# Altium schematic sheet NixieClockv1.1.SchDoc
size A3; SheetNumber: 1; SheetTotal: 1
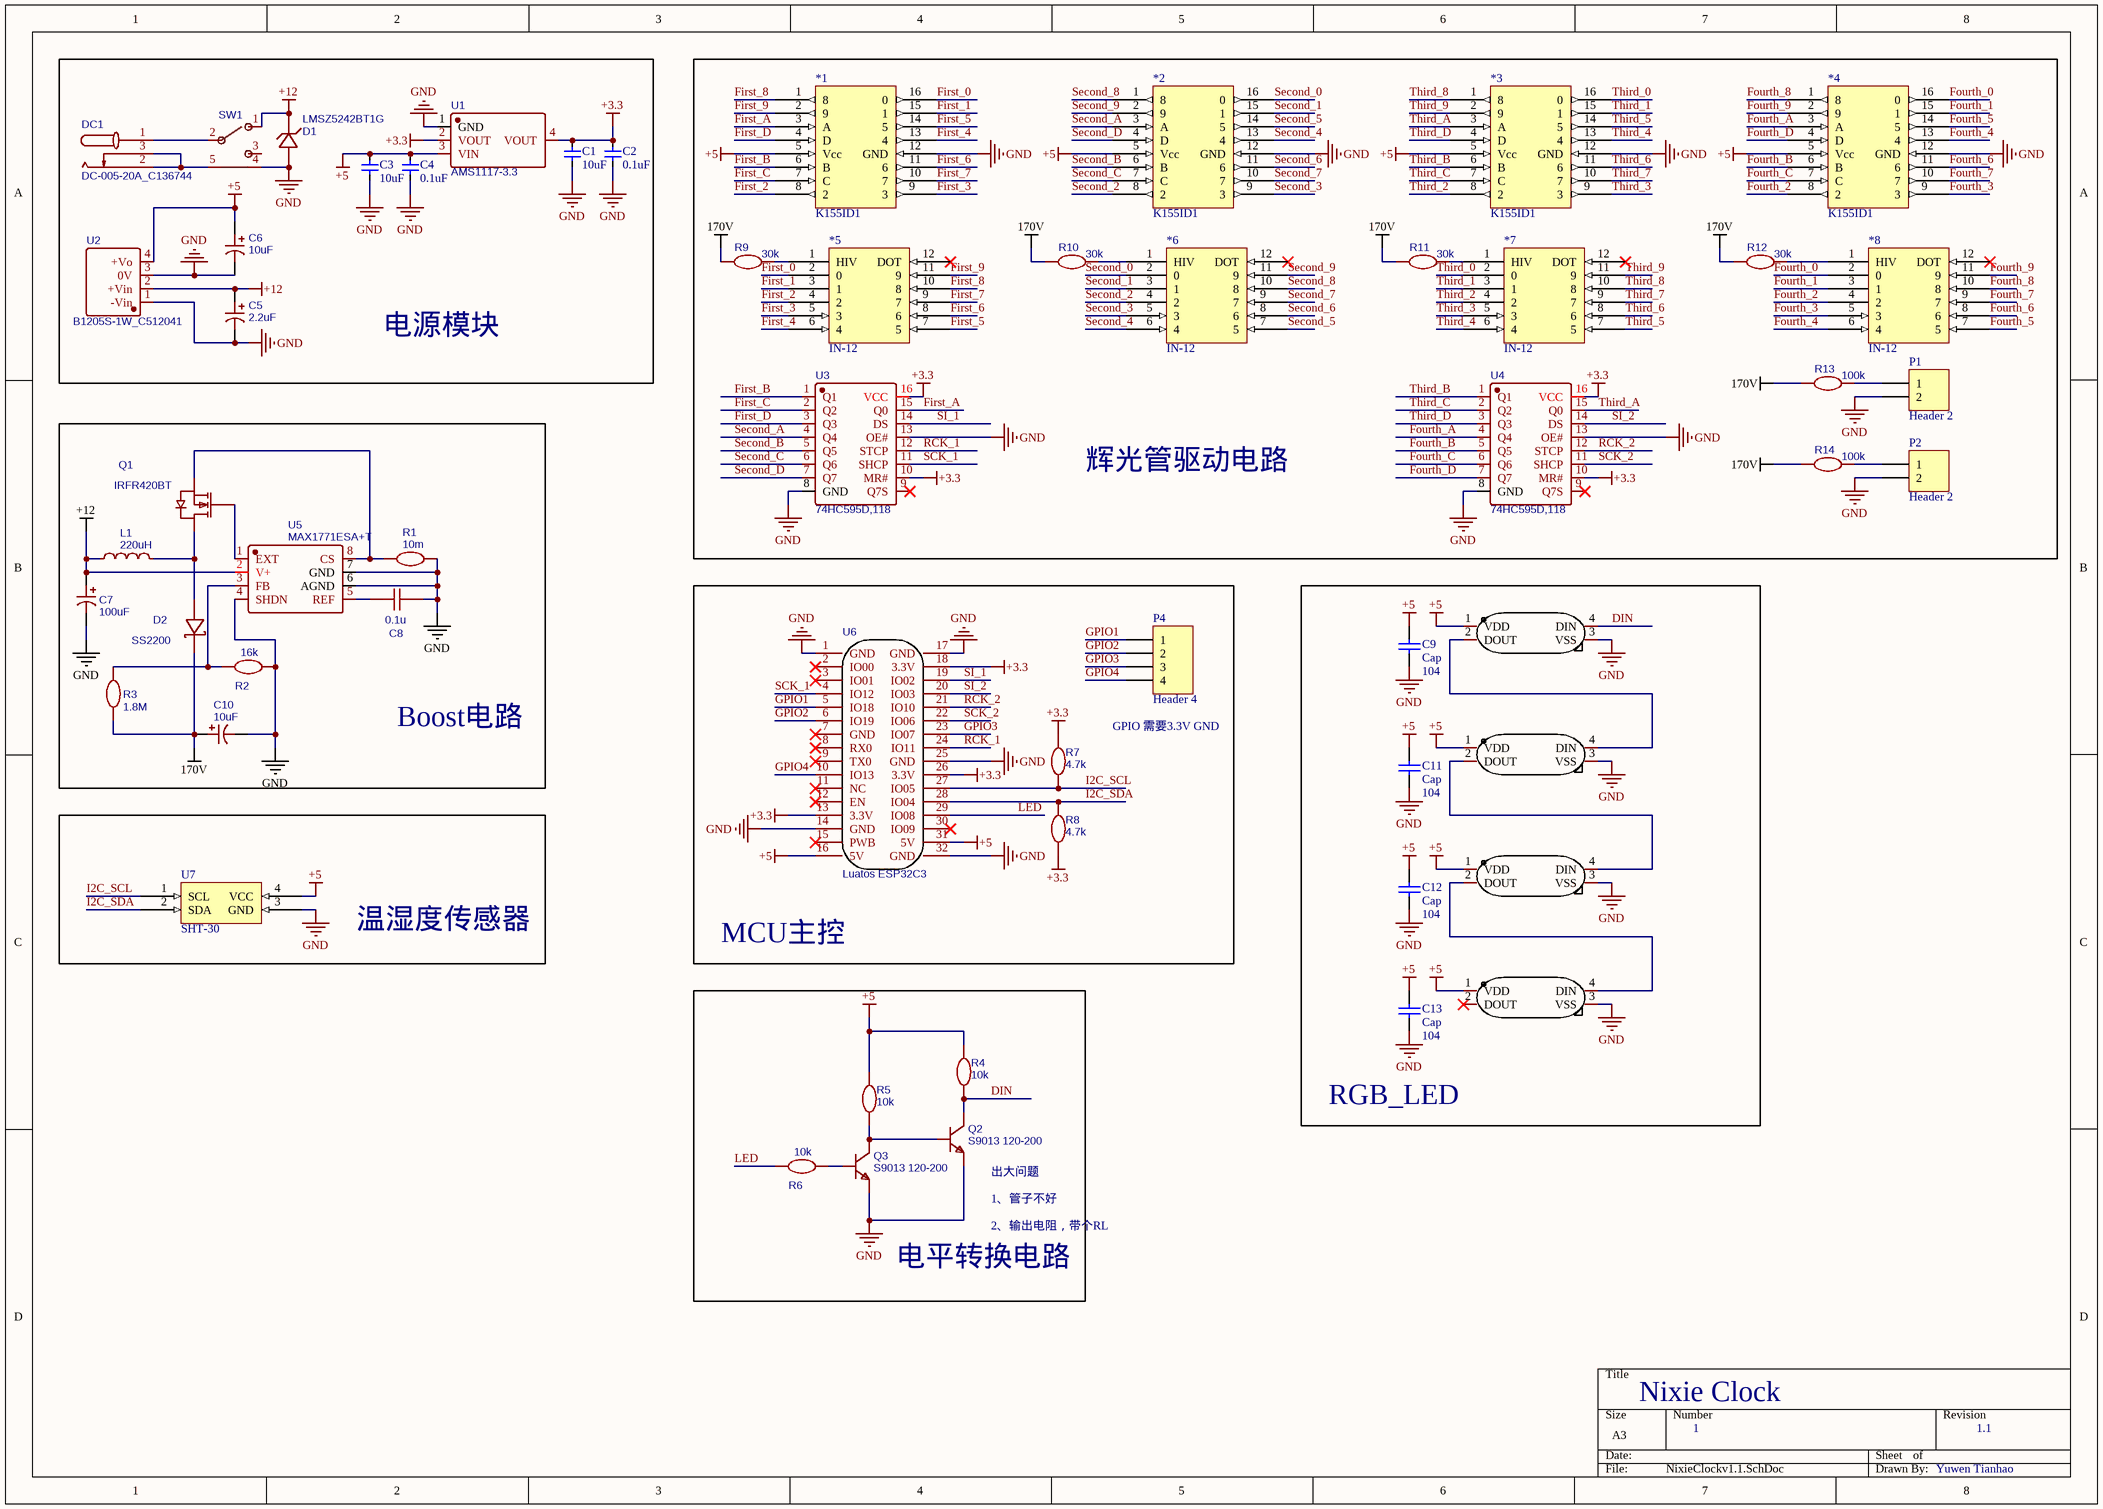
[diagram p0: NixieClockv1.1.SchDoc]

## Parts
*1  K155ID1  [K155ID1]
*2  K155ID1  [K155ID1]
*3  K155ID1  [K155ID1]
*4  K155ID1  [K155ID1]
*5  IN-12  [IN12]
*6  IN-12  [IN12]
*7  IN-12  [IN12]
*8  IN-12  [IN12]
C1  10uF  [C0805]
C2  0.1uF  [0805C]
C3  10uF  [0805C]
C4  0.1uF  [0805C]
C5  2.2uF  [CAP-TH_BD8.0-P3.50-D0.5-FD]
C6  10uF  [CAP-TH_BD8.0-P3.50-D0.5-FD]
C7  100uF  [CAP-TH_BD8.0-P3.50-D0.5-FD]
C8  0.1u  [0805C]
C9  Cap  value 104  [C 0805_M]
C10  10uF  [CAP-TH_BD8.0-P3.50-D0.5-FD]
C11  Cap  value 104  [C 0805_M]
C12  Cap  value 104  [C 0805_M]
C13  Cap  value 104  [C 0805_M]
D1  LMSZ5242BT1G  [SOD-123_L2.7-W1.6-LS3.7-RD]
D2  SS2200  [SMB_L4.6-W3.6-LS5.3-R-RD]
DC1  DC-005-20A_C136744  [DC-IN-TH_DC-005-20A]
L1  220uH  [IND-SMD_L12.0-W12.0]
LED1  WS2812B-B  [LED-SMD_4P-L5.0-W5.0-BL_TC5050RGB]  (value not drawn)
LED2  WS2812B-B  [LED-SMD_4P-L5.0-W5.0-BL_TC5050RGB]  (value not drawn)
LED3  WS2812B-B  [LED-SMD_4P-L5.0-W5.0-BL_TC5050RGB]  (value not drawn)
LED4  WS2812B-B  [LED-SMD_4P-L5.0-W5.0-BL_TC5050RGB]  (value not drawn)
P1  Header 2  [HDR1X2]
P2  Header 2  [HDR1X2]
P4  Header 4  [HDR1X4]
Q1  IRFR420BT  [TO-252-2_L6.5-W6.1-P4.56-LS9.9-BR-CW]
Q2  S9013 120-200  [SOT-23-3_L2.9-W1.6-P1.90-LS2.8-BR]
Q3  S9013 120-200  [SOT-23-3_L2.9-W1.6-P1.90-LS2.8-BR]
R1  10m  [2512R]
R2  16k  [0805R]
R3  1.8M  [0805R]
R4  10k  [0805R]
R5  10k  [0805R]
R6  10k  [0805R]
R7  4.7k  [0805R]
R8  4.7k  [0805R]
R9  30k  [0805R]
R10  30k  [0805R]
R11  30k  [0805R]
R12  30k  [0805R]
R13  100k  [0805R]
R14  100k  [0805R]
SW1  (no value)  [SW-TH_ST-0-102-C03-N003-RS]
U1  AMS1117-3.3  [SOT-223-3_L6.5-W3.4-P2.30-LS7.0-BR]
U2  B1205S-1W_C512041  [PWRM-TH_BXXXXS-1W]
U3  74HC595D,118  [SOIC-16_L9.9-W3.9-P1.27-LS6.0-BL]
U4  74HC595D,118  [SOIC-16_L9.9-W3.9-P1.27-LS6.0-BL]
U5  MAX1771ESA+T  [SO-8_L4.9-W3.9-P1.27-LS6.0-BL]
U6  Luatos ESP32C3  [LUATOS-ESP32C3]
U7  SHT-30  [HDR1X4]

## Blocks framed on the sheet
电源模块: C1-C6 D1 DC1 SW1 U1 U2
辉光管驱动电路: *1-*8 P1 P2 R9-R14 U3 U4
Boost电路: C7 C8 C10 D2 L1 Q1 R1-R3 U5
MCU主控: P4 R7 R8 U6
RGB_LED: C9 C11-C13 LED1-LED4
温湿度传感器: U7
电平转换电路: Q2 Q3 R4-R6

## Nets
170V: C10.1 D2.2(K) R3.1 R9.1 R10.1 R11.1 R12.1 R13.1 R14.1
+3.3: C1.2 C2.2 R7.1 R8.1 U1.2(VOUT) U1.4(VOUT) U3.10(MR#) U3.16(VCC) U4.10(MR#) U4.16(VCC) U6.13(3.3V) U6.18(3.3V) U6.26(3.3V)
+5: *1.5(Vcc) *2.5(Vcc) *3.5(Vcc) *4.5(Vcc) C3.2 C4.2 C6.1 C9.2 C11.2 C12.2 C13.2 LED1.1(VDD) LED2.1(VDD) LED3.1(VDD) LED4.1(VDD) R4.1 R5.1 U1.3(VIN) U2.4(+Vo) U6.16(5V) U6.31(5V) U7.4(VCC)
+12: C5.1 C7.1 D1.1(C) L1.1 SW1.1 U2.2(+Vin) U5.2(V+)
GND: *1.12(GND) *2.12(GND) *3.12(GND) *4.12(GND) C1.1 C2.1 C3.1 C4.1 C5.2 C6.2 C7.2 C8.2 C9.1 C10.2 C11.1 C12.1 C13.1 D1.2(A) LED1.3(VSS) LED2.3(VSS) LED3.3(VSS) LED4.3(VSS) P1.2 P2.2 Q2.2 Q3.2 R1.2 R2.1 SW1.4 U1.1(GND) U2.1(-Vin) U2.3(0V) U3.8(GND) U3.13(OE#) U4.8(GND) U4.13(OE#) U5.4(SHDN) U5.6(AGND) U5.7(GND) U6.1(GND) U6.14(GND) U6.17(GND) U6.25(GND) U6.32(GND) U7.3(GND)
DIN: LED1.4(DIN) Q2.3 R4.2
First_0: *1.16(0) *5.2(0)
First_1: *1.15(1) *5.3(1)
First_2: *1.8(2) *5.4(2)
First_3: *1.9(3) *5.5(3)
First_4: *1.13(4) *5.6(4)
First_5: *1.14(5) *5.7(5)
First_6: *1.11(6) *5.8(6)
First_7: *1.10(7) *5.9(7)
First_8: *1.1(8) *5.10(8)
First_9: *1.2(9) *5.11(9)
First_A: *1.3(A) U3.15(Q0)
First_B: *1.6(B) U3.1(Q1)
First_C: *1.7(C) U3.2(Q2)
First_D: *1.4(D) U3.3(Q3)
Fourth_0: *4.16(0) *8.2(0)
Fourth_1: *4.15(1) *8.3(1)
Fourth_2: *4.8(2) *8.4(2)
Fourth_3: *4.9(3) *8.5(3)
Fourth_4: *4.13(4) *8.6(4)
Fourth_5: *4.14(5) *8.7(5)
Fourth_6: *4.11(6) *8.8(6)
Fourth_7: *4.10(7) *8.9(7)
Fourth_8: *4.1(8) *8.10(8)
Fourth_9: *4.2(9) *8.11(9)
Fourth_A: *4.3(A) U4.4(Q4)
Fourth_B: *4.6(B) U4.5(Q5)
Fourth_C: *4.7(C) U4.6(Q6)
Fourth_D: *4.4(D) U4.7(Q7)
GPIO1: P4.1 U6.5(IO18)
GPIO2: P4.2 U6.6(IO19)
GPIO3: P4.3 U6.23(IO07)
GPIO4: P4.4 U6.10(IO13)
I2C_SCL: R7.2 U6.27(IO05) U7.1(SCL)
I2C_SDA: R8.2 U6.28(IO04) U7.2(SDA)
LED: R6.2 U6.29(IO08)
RCK_1: U3.12(STCP) U6.24(IO11)
RCK_2: U4.12(STCP) U6.21(IO10)
SCK_1: U3.11(SHCP) U6.4(IO12)
SCK_2: U4.11(SHCP) U6.22(IO06)
Second_0: *2.16(0) *6.2(0)
Second_1: *2.15(1) *6.3(1)
Second_2: *2.8(2) *6.4(2)
Second_3: *2.9(3) *6.5(3)
Second_4: *2.13(4) *6.6(4)
Second_5: *2.14(5) *6.7(5)
Second_6: *2.11(6) *6.8(6)
Second_7: *2.10(7) *6.9(7)
Second_8: *2.1(8) *6.10(8)
Second_9: *2.2(9) *6.11(9)
Second_A: *2.3(A) U3.4(Q4)
Second_B: *2.6(B) U3.5(Q5)
Second_C: *2.7(C) U3.6(Q6)
Second_D: *2.4(D) U3.7(Q7)
SI_1: U3.14(DS) U6.19(IO02)
SI_2: U4.14(DS) U6.20(IO03)
Third_0: *3.16(0) *7.2(0)
Third_1: *3.15(1) *7.3(1)
Third_2: *3.8(2) *7.4(2)
Third_3: *3.9(3) *7.5(3)
Third_4: *3.13(4) *7.6(4)
Third_5: *3.14(5) *7.7(5)
Third_6: *3.11(6) *7.8(6)
Third_7: *3.10(7) *7.9(7)
Third_8: *3.1(8) *7.10(8)
Third_9: *3.2(9) *7.11(9)
Third_A: *3.3(A) U4.15(Q0)
Third_B: *3.6(B) U4.1(Q1)
Third_C: *3.7(C) U4.2(Q2)
Third_D: *3.4(D) U4.3(Q3)
Net*5_1: *5.1(HIV) R9.2
Net*6_1: *6.1(HIV) R10.2
Net*7_1: *7.1(HIV) R11.2
Net*8_1: *8.1(HIV) R12.2
NetC8_1: C8.1 U5.5(REF)
NetD2_1: D2.1(A) L1.2 Q1.2(D)
NetDC1_1: DC1.1 SW1.2
NetDC1_2: DC1.2 DC1.3 SW1.5
NetLED1_2: LED1.2(DOUT) LED2.4(DIN)
NetLED2_2: LED2.2(DOUT) LED3.4(DIN)
NetLED3_2: LED3.2(DOUT) LED4.4(DIN)
NetP1_1: P1.1 R13.2
NetP2_1: P2.1 R14.2
NetQ1_1: Q1.1(G) U5.1(EXT)
NetQ1_3: Q1.3(S) R1.1 U5.8(CS)
NetQ2_1: Q2.1 Q3.3 R5.2
NetQ3_1: Q3.1 R6.1
NetR2_2: R2.2 R3.2 U5.3(FB)

Not connected (* = marked no-connect by the designer): *5 12(DOT)*; *6 12(DOT)*; *7 12(DOT)*; *8 12(DOT)*; LED4 2(DOUT)*; SW1 3; U3 9(Q7S)*; U4 9(Q7S)*; U6 2(IO00)* 3(IO01)* 7(GND)* 8(RX0)* 9(TX0)* 11(NC)* 12(EN)* 15(PWB)* 30(IO09)*

## Notes on the sheet
- GPIO 需要3.3V GND
- (near Q2) 出大问题
- (near Q2) 1、管子不好
- 2、输出电阻，带个RL
- Nixie Clock
- 1
- 1.1
- Yuwen Tianhao

## Library data of the parts
*5-*8 = IN-12: pin to pad: 3>11 4>10 5>9 6>8 8>6 9>5 10>4 11>3
C1-C4 = C: Capacitor
C5 C6 C10 = 10uF: BOM_Manufacturer: UNITED(怡德); BOM_Manufacturer Part: LW100M2500814PE4; nameAlias: Capacitance; Contributor: LCSC; BOM_Supplier: LCSC; BOM_Supplier Part: C2847238; BOM_JLCPCB Part Class: Extended Part; spicePre: C; spiceSymbolName: LW100M2500814PE4
C7 = 100uF: BOM_Manufacturer: UNITED(怡德); BOM_Manufacturer Part: LW100M2500814PE4; nameAlias: Capacitance; Contributor: LCSC; BOM_Supplier: LCSC; BOM_Supplier Part: C2847238; BOM_JLCPCB Part Class: Extended Part; spicePre: C; spiceSymbolName: LW100M2500814PE4
C8 = 0.1u: nameAlias: Value(F); Contributor: LCEDA_Lib; spicePre: C; spiceSymbolName: C_0603_US
C9 C11-C13 = Cap: Capacitor; Published: 8-Jun-2000; LatestRevisionDate: 17-Jul-2002; LatestRevisionNote: Re-released for DXP Platform.; PackageReference: RAD-0.3; Publisher: Altium Limited; PackageDescription: Radial Cap, Thru-Hole; 2 Leads; 0.3 in Pin Spacing
D1 = LMSZ5242BT1G: BOM_Manufacturer: LRC(乐山无线电); Contributor: LCSC; BOM_Supplier: LCSC; BOM_Manufacturer Part: LMSZ5242BT1G; BOM_Supplier Part: C124150; BOM_JLCPCB Part Class: Extended Part; spicePre: D; spiceSymbolName: LMSZ5242BT1G
D2 = SS2200: BOM_Manufacturer: MDD; BOM_Supplier: LCSC; BOM_Manufacturer Part: SS2200; BOM_Supplier Part: C64997; BOM_JLCPCB Part Class: Extended Part; spicePre: D; spiceSymbolName: SS2200
DC1 = DC-005-20A_C136744: BOM_Manufacturer: 韩国韩荣; Contributor: LCSC; BOM_Supplier: LCSC; BOM_Manufacturer Part: DC-005-20A; BOM_Supplier Part: C136744; BOM_JLCPCB Part Class: Extended Part; spicePre: D; spiceSymbolName: DC-005-20A_C136744
L1 = 220uH: BOM_Manufacturer: Sunltech Tech; BOM_Manufacturer Part: SLH1207S221MTT; nameAlias: Inductance; Contributor: LCSC; BOM_Supplier: LCSC; BOM_Supplier Part: C182174; BOM_JLCPCB Part Class: Extended Part; spicePre: L; spiceSymbolName: SLH1207S221MTT
LED1-LED4 = WS2812B-B: Manufacturer: worldsemi; Add into BOM: yes; Emitted Color: RGB三色; Name: WS2812B-B; Symbol: WS2812B-B; Device: WS2812B-B; LCSC Part Name: RGB三色 （注意防潮，请查阅规格书中对应具体内容）; Supplier Part: C114586; Manufacturer Part: WS2812B-B; Supplier Footprint: SMD5050; JLCPCB Part Class: Extended Part; Datasheet: https://atta.szlcsc.com/upload/public/pdf/source/20200615/C114586_26EB6813EC9F2A3F6C7FBB2AD75DE01F.pdf; Supplier: LCSC; Convert to PCB: yes
P1 P2 = Header 2: Header, 2-Pin; LatestRevisionDate: 17-Jul-2002; LatestRevisionNote: Re-released for DXP Platform.; Publisher: Altium Limited
P4 = Header 4: Header, 4-Pin; LatestRevisionDate: 17-Jul-2002; LatestRevisionNote: Re-released for DXP Platform.; Publisher: Altium Limited
Q1 = IRFR420BT: BOM_Manufacturer: VBsemi Elec; Contributor: LCSC; BOM_Supplier: LCSC; BOM_Supplier Part: C878947; BOM_Manufacturer Part: IRFR420BT; BOM_JLCPCB Part Class: Extended Part; spicePre: Q; spiceSymbolName: IRFR420BT
Q2 Q3 = S9013 120-200: BOM_Manufacturer: CJ(江苏长电/长晶); BOM_Supplier: LCSC; BOM_Manufacturer Part: S9013; BOM_Supplier Part: C107404; BOM_JLCPCB Part Class: Extended Part; spicePre: Q; spiceSymbolName: S9013 120-200
R1 = 10m: nameAlias: Value(Ω); Contributor: LCEDA_Lib; spicePre: R; spiceSymbolName: R_0805_EU
R2 R4-R14 = 1.6k: nameAlias: Value(Ω); Contributor: LCEDA_Lib; spicePre: R; spiceSymbolName: R_0805_EU
R3 = 1.8M: nameAlias: Value(Ω); Contributor: LCEDA_Lib; spicePre: R; spiceSymbolName: R_0805_EU
SW1 = ST-0-102-C03-N003-RS: BOM_Manufacturer: YUEN FUNG(源丰); Contributor: LCSC; BOM_Supplier: LCSC; BOM_Supplier Part: C1788489; BOM_Manufacturer Part: ST-0-102-C03-N003-RS; BOM_JLCPCB Part Class: Extended Part; spicePre: S; spiceSymbolName: ST-0-102-C03-N003-RS
U1 = AMS1117-3.3: BOM_Manufacturer: AMS; sourceId: dwIGgezVh; timeStamp: 1476261164; BOM_Supplier: LCSC; BOM_Manufacturer Part: AMS1117-3.3; BOM_Supplier Part: C6186; BOM_JLCPCB Part Class: Basic Part; spicePre: U; spiceSymbolName: AMS1117-3.3
U2 = B1205S-1W_C512041: BOM_Manufacturer: rlt; Contributor: LCSC; BOM_Supplier: LCSC; BOM_Supplier Part: C512041; BOM_Manufacturer Part: B1205S-1W; BOM_JLCPCB Part Class: Extended Part; spicePre: U; spiceSymbolName: B1205S-1W_C512041
U3 U4 = 74HC595D,118: BOM_Manufacturer: Nexperia(安世); spicePre: X; BOM_Supplier: LCSC; BOM_Manufacturer Part: 74HC595D,118; BOM_Supplier Part: C5947; BOM_JLCPCB Part Class: Basic Part; spiceSymbolName: 74HC595D,118
U5 = MAX1771ESA+T: BOM_Manufacturer: Maxim Integrated; Contributor: LCSC; BOM_Supplier: LCSC; BOM_Supplier Part: C407903; BOM_Manufacturer Part: MAX1771ESA+T; BOM_JLCPCB Part Class: Extended Part; spicePre: U; spiceSymbolName: MAX1771ESA+T
U6 = Luatos ESP32C3: Contributor: KagurazakaTsuki; BOM_Supplier: LUATOS; link: https://wiki.luatos.com/chips/esp32c3/board.html; spicePre: U; spiceSymbolName: Luatos ESP32C3